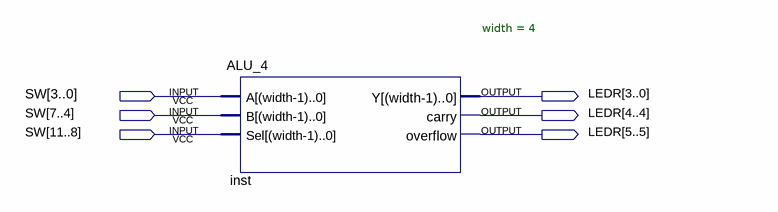
[diagram p0: schematic sheet]
// Quartus schematic block_ALU4.bdf as structural Verilog: 1 symbols, 6 pins
module block_ALU4 (
  input  [11:0] SW,
  output [5:0] LEDR
);

  ALU_4 #(.width(4)) inst (
    .A(SW[3:0]), .B(SW[7:4]), .Sel(SW[11:8]), .Y(LEDR[3:0]), .carry(LEDR[4]), .overflow(LEDR[5]));
endmodule
